# EasyEDA schematic SCH_Big Knob.json
TITLE: Big knob; REV: 1.0; Date: 2023-09-26; Sheet: 1/1; Company: Jpe230
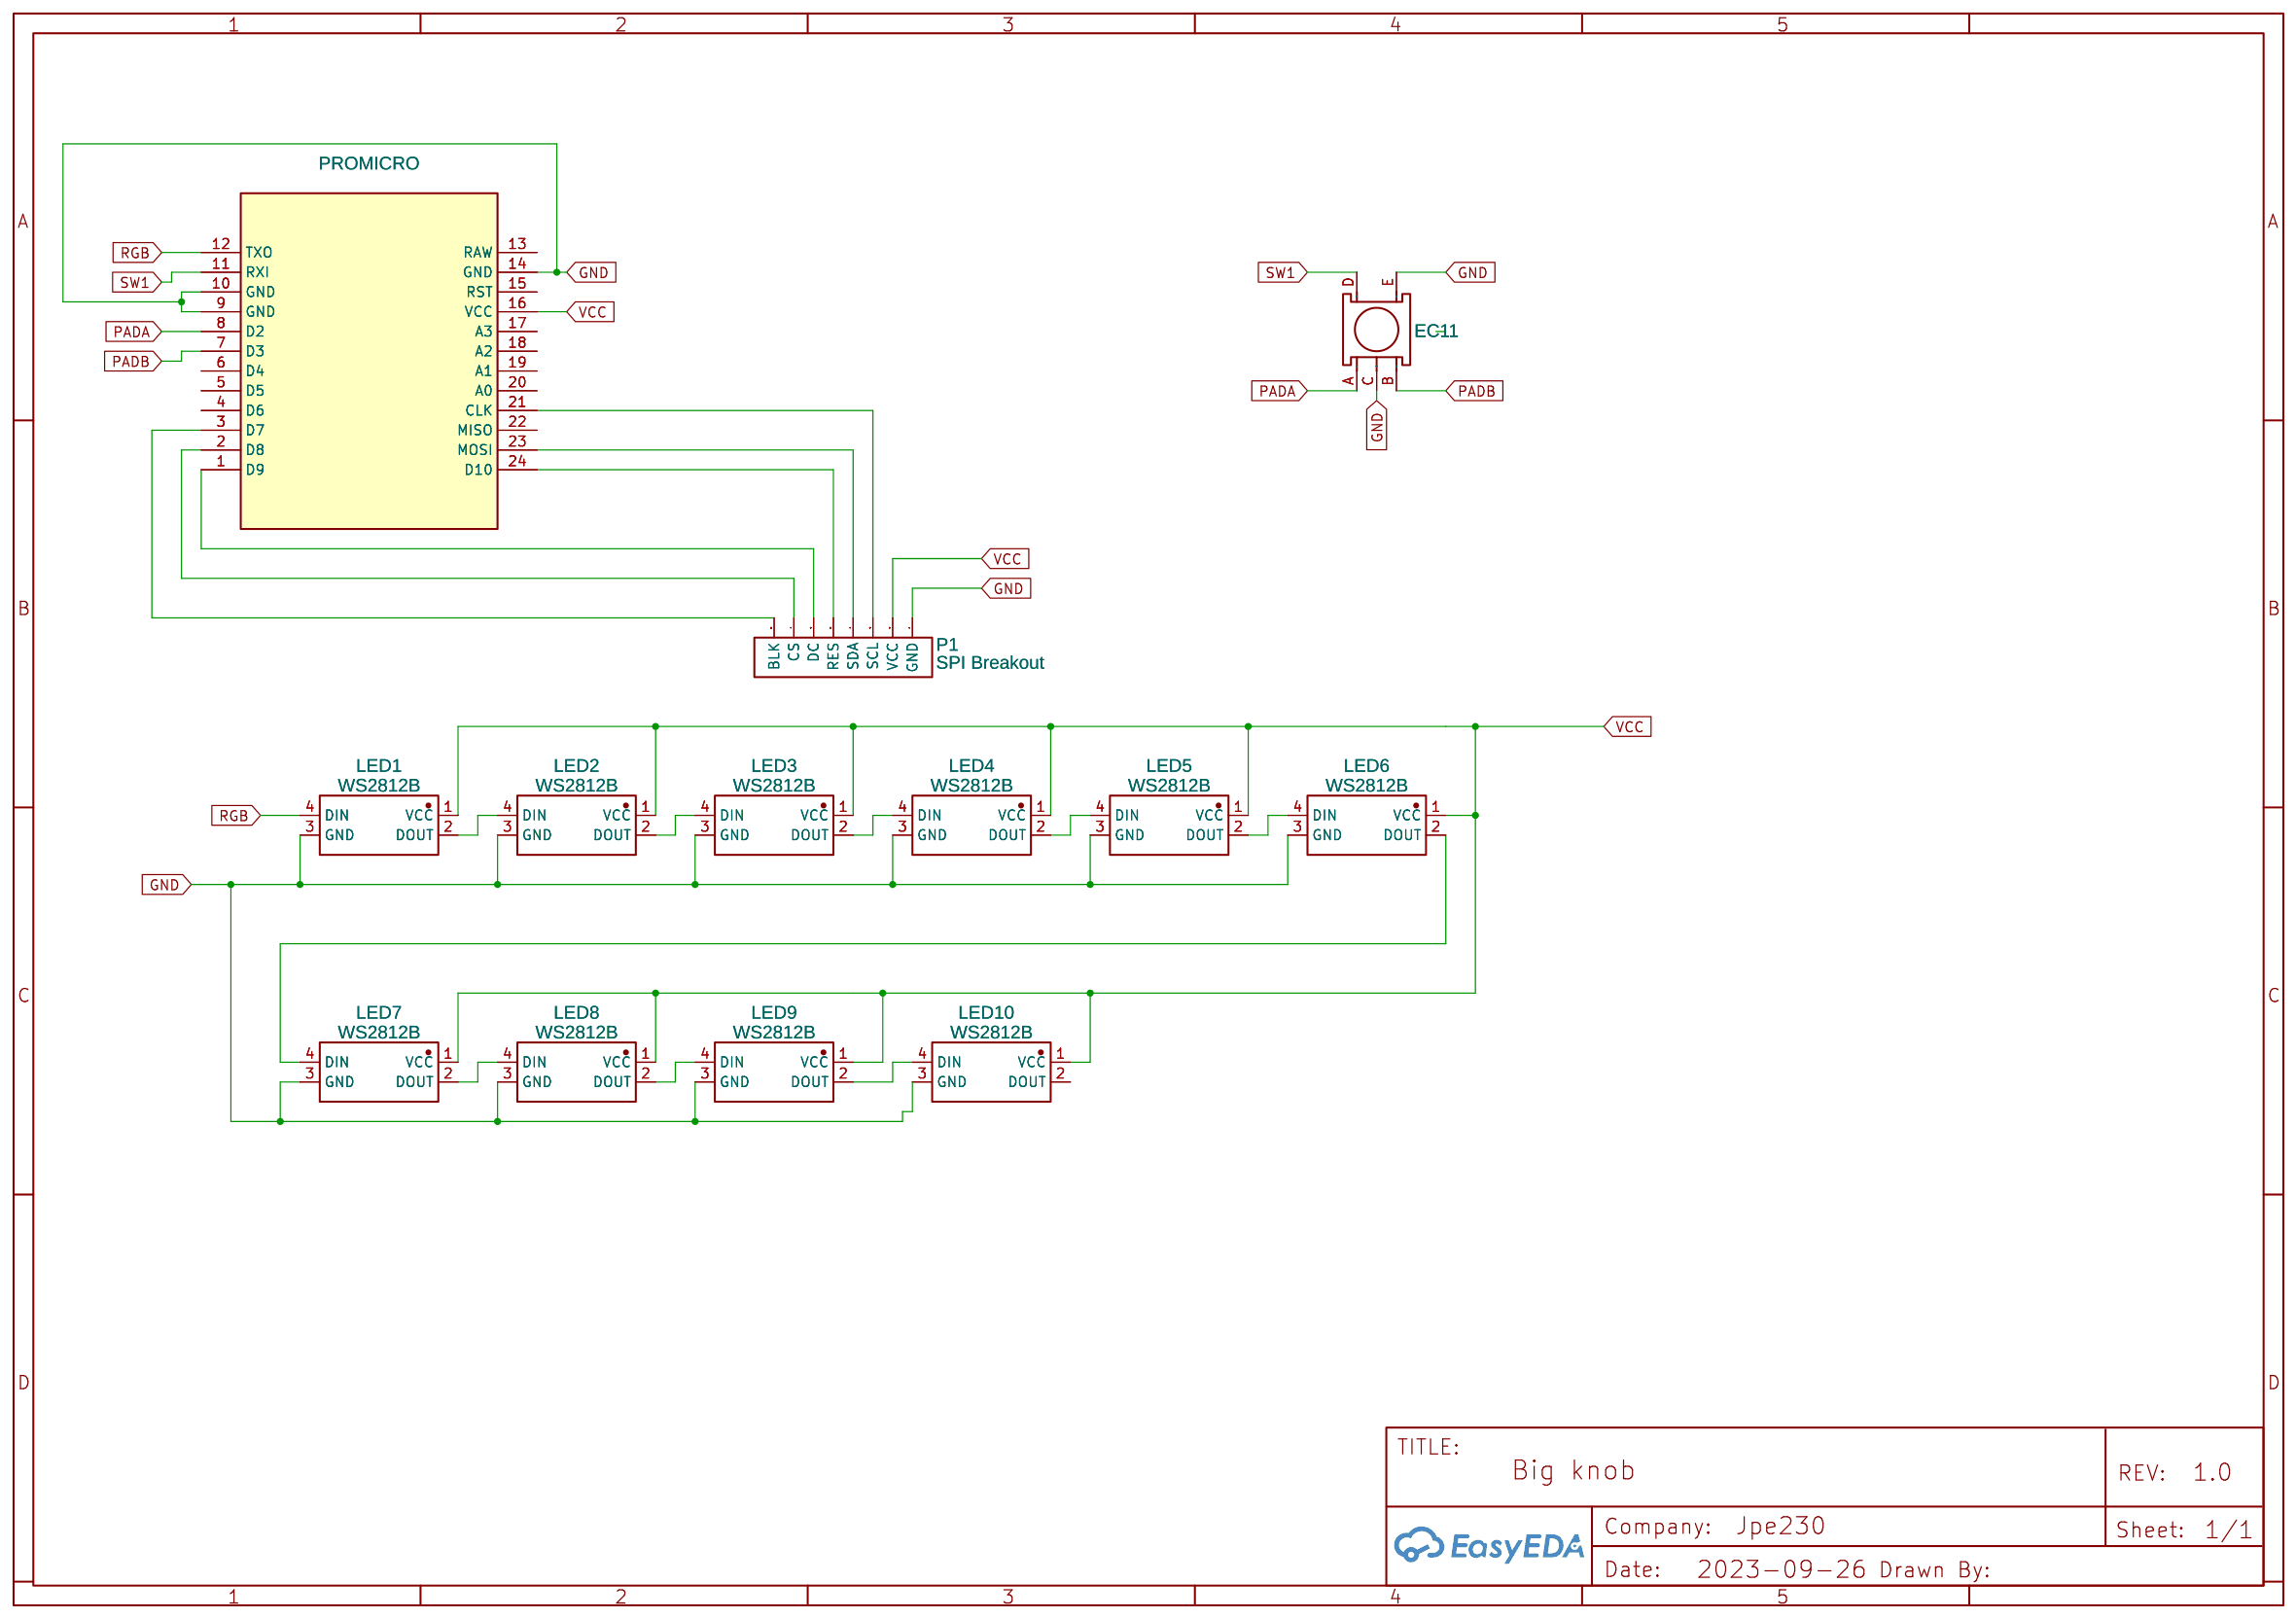
[diagram p0: schematic sheet]

## Parts
EC11  NO  [SW-TH_EC11]
LED1  WS2812B  [LED-SMD_5050WS2812B]
LED2  WS2812B  [LED-SMD_5050WS2812B]
LED3  WS2812B  [LED-SMD_5050WS2812B]
LED4  WS2812B  [LED-SMD_5050WS2812B]
LED5  WS2812B  [LED-SMD_5050WS2812B]
LED6  WS2812B  [LED-SMD_5050WS2812B]
LED7  WS2812B  [LED-SMD_5050WS2812B]
LED8  WS2812B  [LED-SMD_5050WS2812B]
LED9  WS2812B  [LED-SMD_5050WS2812B]
LED10  WS2812B  [LED-SMD_5050WS2812B]
P1  SPI Breakout  [HDR-TH_8P-P2.54-V-F-1]
PROMICRO  NO  [PRO MICRO - 5V]

## Library data of the parts
EC11 = EC11: Supplier: LCSC; Supplier Part: C470709; Manufacturer: ALPSALPINE(阿尔卑斯阿尔派); Manufacturer Part: EC11E09204A4; Contributor: mizzzzon; JLCPCB Part Class: Extended Part
LED1-LED10 = 5050WS2812B: Contributor: LCSC; Supplier: LCSC; Supplier Part: C2874876; Manufacturer: null; JLCPCB Part Class: Extended Part; link: https://lcsc.com/eda_search?q=C2874876&%26type=1&ref=editor
P1 = Header-Female-2.54_1x8: Supplier: LCSC; Manufacturer: BOOMELE(博穆精密); Manufacturer Part: 2.54-1*8P母环保; Supplier Part: C27438; JLCPCB Part Class: Extended Part; link: https://lcsc.com/eda_search?q=C27438&%26type=1&ref=editor
PROMICRO = Pro Micro - 5V: sourceId: 1T5FDZYC8

## Nets
GND: EC11.C EC11.E LED1.3(GND) LED2.3(GND) LED3.3(GND) LED4.3(GND) LED5.3(GND) LED6.3(GND) LED7.3(GND) LED8.3(GND) LED9.3(GND) LED10.3(GND) P1.1(GND) PROMICRO.9(GND) PROMICRO.10(GND) PROMICRO.14(GND)
VCC: LED1.1(VCC) LED2.1(VCC) LED3.1(VCC) LED4.1(VCC) LED5.1(VCC) LED6.1(VCC) LED7.1(VCC) LED8.1(VCC) LED9.1(VCC) LED10.1(VCC) P1.2(VCC) PROMICRO.16(VCC)
PADA: EC11.A PROMICRO.8(D2)
PADB: EC11.B PROMICRO.7(D3)
RGB: LED1.4(DIN) PROMICRO.12(TXO)
SW1: EC11.D PROMICRO.11(RXI)
Net-(LED1-2): LED1.2(DOUT) LED2.4(DIN)
Net-(LED2-2): LED2.2(DOUT) LED3.4(DIN)
Net-(LED3-2): LED3.2(DOUT) LED4.4(DIN)
Net-(LED4-2): LED4.2(DOUT) LED5.4(DIN)
Net-(LED5-2): LED5.2(DOUT) LED6.4(DIN)
Net-(LED6-2): LED6.2(DOUT) LED7.4(DIN)
Net-(LED7-2): LED7.2(DOUT) LED8.4(DIN)
Net-(LED8-2): LED8.2(DOUT) LED9.4(DIN)
Net-(LED9-2): LED9.2(DOUT) LED10.4(DIN)
Net-(P1-3): P1.3(SCL) PROMICRO.21(CLK)
Net-(P1-4): P1.4(SDA) PROMICRO.23(MOSI)
Net-(P1-5): P1.5(RES) PROMICRO.24(D10)
Net-(P1-6): P1.6(DC) PROMICRO.1(D9)
Net-(P1-7): P1.7(CS) PROMICRO.2(D8)
Net-(P1-8): P1.8(BLK) PROMICRO.3(D7)

Not connected (* = marked no-connect by the designer): LED10 2(DOUT); PROMICRO 4(D6) 5(D5) 6(D4) 13(RAW) 15(RST) 17(A3) 18(A2) 19(A1) 20(A0) 22(MISO)
